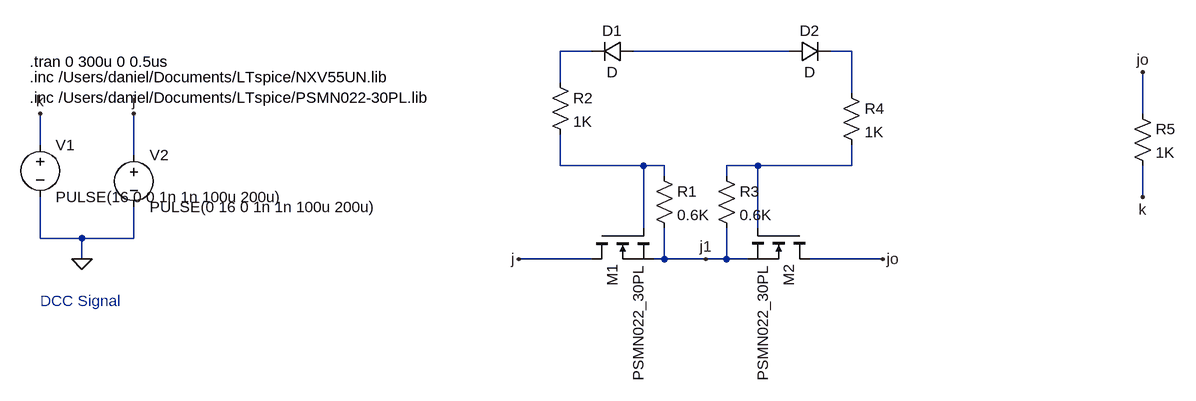
[diagram p0: schematic dccAbc2.asc]
dccAbc2.asc, the LTspice schematic file:
Version 4
SHEET 1 880 680
WIRE -1008 -832 -1056 -832
WIRE -704 -832 -944 -832
WIRE -608 -832 -640 -832
WIRE -1056 -784 -1056 -832
WIRE -608 -768 -608 -832
WIRE -160 -736 -160 -800
WIRE -1856 -688 -1856 -736
WIRE -1712 -672 -1712 -736
WIRE -1056 -656 -1056 -704
WIRE -928 -656 -1056 -656
WIRE -896 -656 -928 -656
WIRE -752 -656 -800 -656
WIRE -608 -656 -608 -688
WIRE -608 -656 -752 -656
WIRE -896 -640 -896 -656
WIRE -800 -640 -800 -656
WIRE -160 -608 -160 -656
WIRE -928 -560 -928 -656
WIRE -752 -560 -752 -656
WIRE -1856 -544 -1856 -608
WIRE -1792 -544 -1856 -544
WIRE -1712 -544 -1712 -592
WIRE -1712 -544 -1792 -544
WIRE -1792 -512 -1792 -544
WIRE -1008 -512 -1120 -512
WIRE -896 -512 -896 -560
WIRE -896 -512 -912 -512
WIRE -832 -512 -896 -512
WIRE -800 -512 -800 -560
WIRE -800 -512 -832 -512
WIRE -768 -512 -800 -512
WIRE -560 -512 -672 -512
FLAG -1792 -512 0
FLAG -1712 -736 j
FLAG -1856 -736 k
FLAG -1120 -512 j
FLAG -832 -512 j1
FLAG -560 -512 jo
FLAG -160 -800 jo
FLAG -160 -608 k
SYMBOL voltage -1712 -688 R0
SYMATTR InstName V2
SYMATTR Value PULSE(0 16 0 1n 1n 100u 200u)
SYMBOL voltage -1856 -704 R0
SYMATTR InstName V1
SYMATTR Value PULSE(16 0 0 1n 1n 100u 200u)
SYMBOL nmos -1008 -560 M90
SYMATTR InstName M1
SYMATTR Value PSMN022_30PL
SYMATTR Prefix X
SYMBOL nmos -672 -560 R90
SYMATTR InstName M2
SYMATTR Value PSMN022_30PL
SYMATTR Prefix X
SYMBOL res -912 -656 R0
SYMATTR InstName R1
SYMATTR Value 0.6K
SYMBOL res -1072 -800 R0
SYMATTR InstName R2
SYMATTR Value 1K
SYMBOL res -816 -656 R0
SYMATTR InstName R3
SYMATTR Value 0.6K
SYMBOL res -624 -784 R0
SYMATTR InstName R4
SYMATTR Value 1K
SYMBOL diode -944 -848 R90
WINDOW 0 0 32 VBottom 2
WINDOW 3 32 32 VTop 2
SYMATTR InstName D1
SYMBOL diode -704 -848 M90
WINDOW 0 0 32 VBottom 2
WINDOW 3 32 32 VTop 2
SYMATTR InstName D2
SYMBOL res -176 -752 R0
SYMATTR InstName R5
SYMATTR Value 1K
TEXT -1872 -816 Left 2 !.tran 0 300u 0 0.5us
TEXT -1856 -448 Left 2 ;DCC Signal
TEXT -1872 -792 Left 2 !.inc /Users/daniel/Documents/LTspice/NXV55UN.lib\n.inc /Users/daniel/Documents/LTspice/PSMN022-30PL.lib

The netlist it stands for:
* dccAbc2.asc
V2 j 0 PULSE(0 16 0 1n 1n 100u 200u)
V1 k 0 PULSE(16 0 0 1n 1n 100u 200u)
XM1 j N004 j1 PSMN022_30PL  ; pins D G S
XM2 jo N005 j1 PSMN022_30PL  ; pins D G S
R1 N004 j1 0.6K
R2 N001 N004 1K
R3 N005 j1 0.6K
R4 N003 N005 1K
D1 N002 N001 D
D2 N002 N003 D
R5 jo k 1K
.model D D
.lib standard.dio
.tran 0 300u 0 0.5us
* DCC Signal
.inc /Users/daniel/Documents/LTspice/NXV55UN.lib
.inc /Users/daniel/Documents/LTspice/PSMN022-30PL.lib
.backanno
.end